# EAGLE design Arduino Accelerometer (EAGLE 5.11)
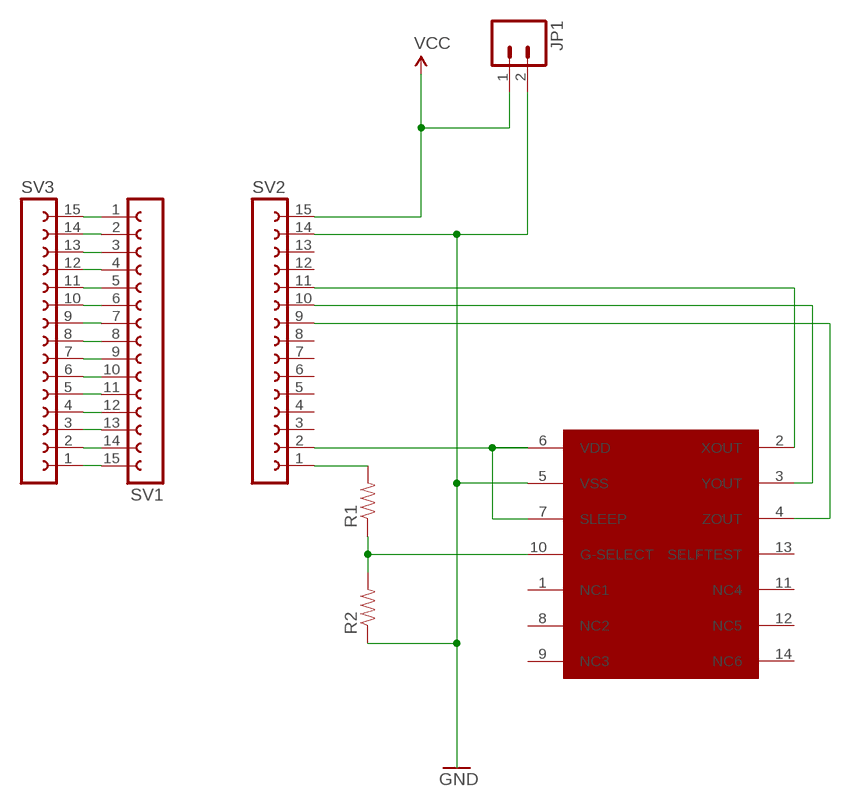
[diagram p0: schematic, sheet 1]

## Parts
JP1  M02LOCK  [1X02_LOCK]
R1  RESISTORPTH-1/4W  [AXIAL-0.4]
R2  RESISTORPTH-1/4W  [AXIAL-0.4]
SV1  FE15-1  [FE15]
SV2  FE15-1  [FE15]
SV3  FE15-1  [FE15]
U$1  MMA7331LC  [LGA14]

## Nets
BLAH: R1.P$1 R2.P$2 U$1.10(G-SELECT)
GND: JP1.2 R2.P$1 SV2.14 U$1.5(VSS)
N$1: SV2.2 U$1.6(VDD) U$1.7(SLEEP)
N$2: SV2.11 U$1.2(XOUT)
N$3: SV2.10 U$1.3(YOUT)
N$4: SV2.9 U$1.4(ZOUT)
N$5: SV1.1 SV3.15
N$6: SV1.2 SV3.14
N$7: R1.P$2 SV2.1
N$8: SV1.5 SV3.11
N$9: SV1.4 SV3.12
N$10: SV1.6 SV3.10
N$11: SV1.7 SV3.9
N$12: SV1.3 SV3.13
N$13: SV1.8 SV3.8
N$14: SV1.9 SV3.7
N$15: SV1.10 SV3.6
N$16: SV1.11 SV3.5
N$17: SV1.12 SV3.4
N$18: SV1.14 SV3.2
N$19: SV1.15 SV3.1
N$20: SV1.13 SV3.3
VCC: JP1.1 SV2.15
Unconnected: SV2.3 SV2.4 SV2.5 SV2.6 SV2.7 SV2.8 SV2.12 SV2.13 U$1.1(NC1) U$1.8(NC2) U$1.9(NC3) U$1.11(NC4) U$1.12(NC5) U$1.13(SELFTEST) U$1.14(NC6)

## Library data of the parts
JP1 = SparkFun:M02: Header 2 Standard 2-pin 0.1" header. Use with straight break away headers (SKU : PRT-00116), right angle break away headers (PRT-00553), swiss pins (PRT-00743), machine pins (PRT-00117), and female headers (PRT-00115). Molex polarized connector foot print use with SKU : PRT-08233 with associated crimp pins and housings.
R1 R2 = SparkFun:RESISTOR: Resistor Basic schematic elements and footprints for 0603, 1206, and PTH resistors.
SV1-SV3 = con-lsta:FE15-1: FEMALE HEADER; OC_FARNELL: unknown; OC_NEWARK: unknown
U$1 = SparkFun:MMA7331LC

## Board
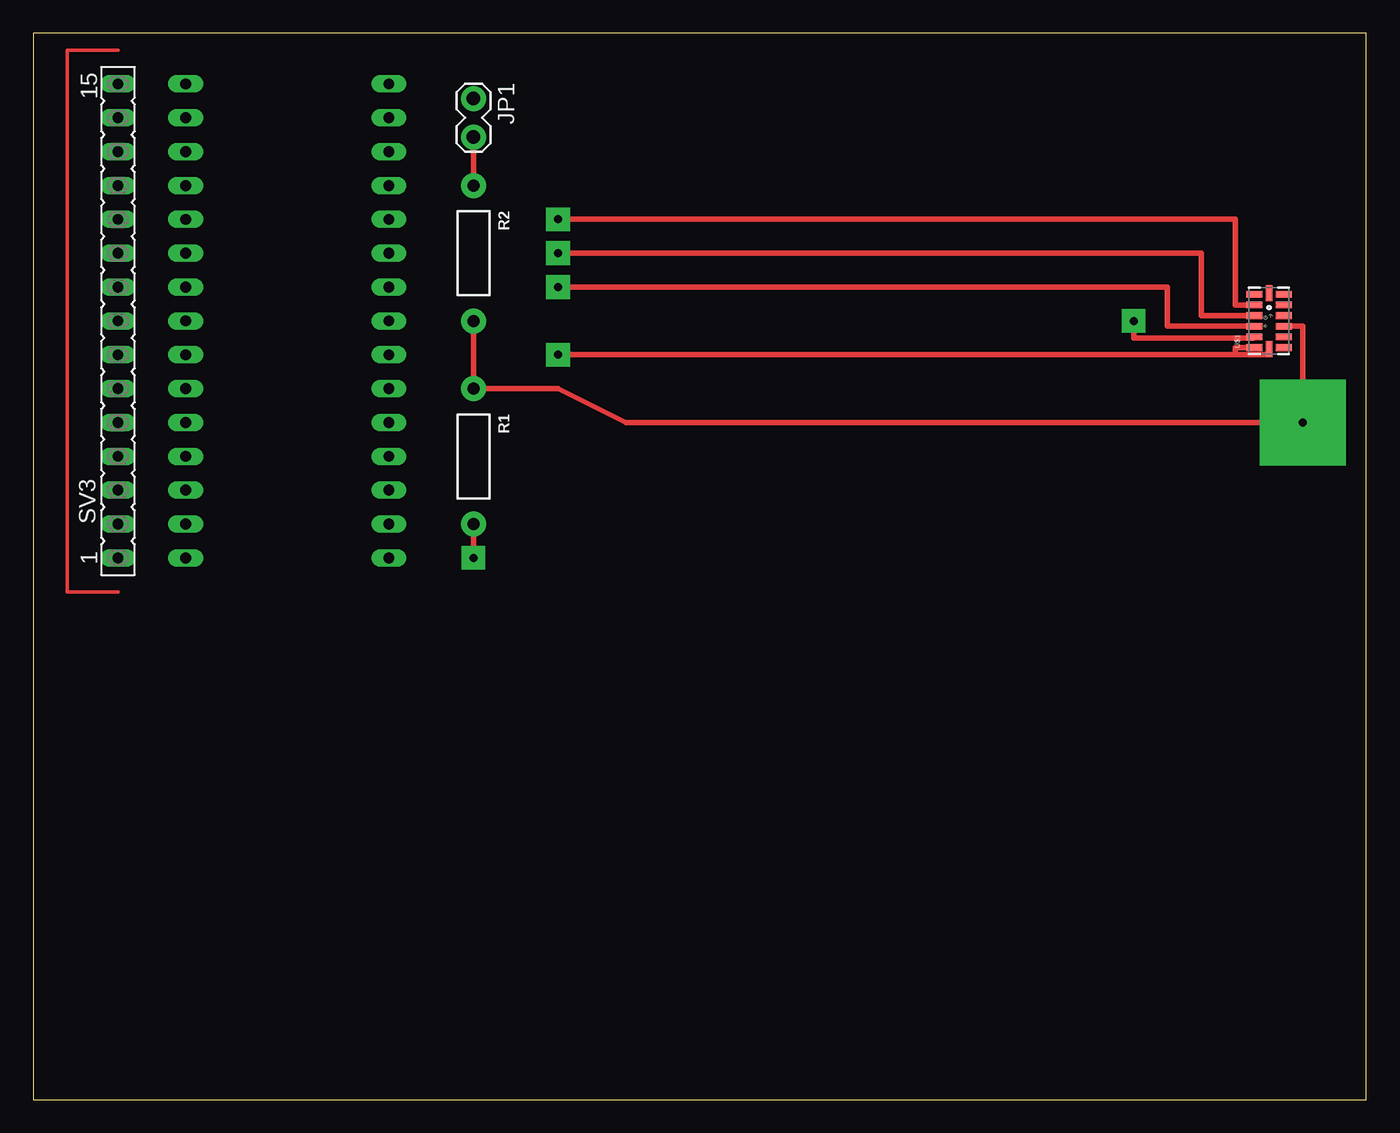
[diagram p1: board, top side]
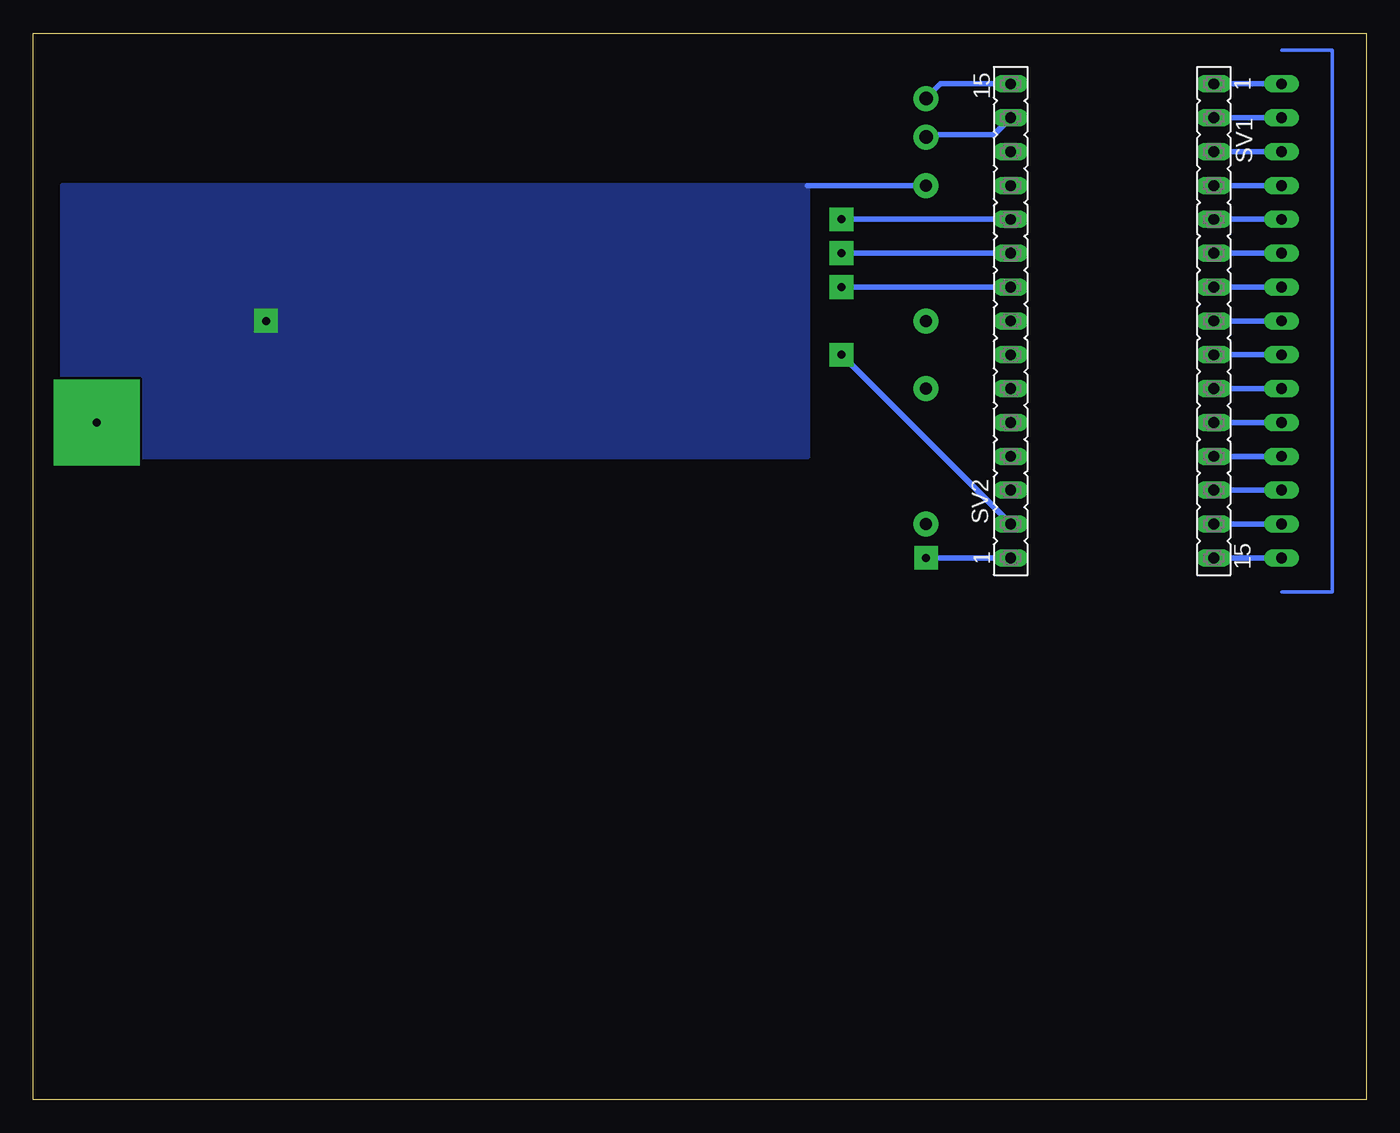
[diagram p2: board, bottom side, seen from below]

Size 100 x 80 mm. Coordinates in mm from the lower left corner, seen from the top.
Outline: 0,0 100,0 100,80 0,80 0,0
Copper layers (1*16): Top 0.035mm / dielectric 1.5mm / Bottom 0.035mm
Design rules "default": minimum track width 10mil, minimum drill 24mil, track to track 8mil, track to pad 8mil, pad to pad 8mil, via to via 8mil, smd to smd 8mil, copper to edge 40mil, drill to drill 8mil, minimum pad ring 10mil, minimum via ring 8mil, stop-mask expansion 4mil, vias tented up to drill 0mil, thermal gap 10mil

### Footprints (pad centres in the part's own frame; a part is rotated, then mirrored left to right if it is on the bottom)
1X02_LOCK = drill 1.016 pad 1.88 round: 1 -0.178,0; 2 2.718,0
AXIAL-0.4 = drill 0.9 pad 1.88 round: P$1 -5.08,0; P$2 5.08,0
FE15 = drill 0.813 long: 1 -17.78,0; 2 -15.24,0; 3 -12.7,0; 4 -10.16,0; 5 -7.62,0; 6 -5.08,0; 7 -2.54,0; 8 0,0; 9 2.54,0; 10 5.08,0; 11 7.62,0; 12 10.16,0; 13 12.7,0; 14 15.24,0; 15 17.78,0
LGA14 = smd 0.5 x 1.2: 1 2,1.1; 2 1.2,1.1; 3 0.4,1.1; 4 -0.4,1.1; 5 -1.2,1.1; 6 -2,1.1; 8 -2,-1.1; 9 -1.2,-1.1; 10 -0.4,-1.1; 11 0.4,-1.1; 12 1.2,-1.1; 13 2,-1.1 | smd 1.2 x 0.5: 7 -2.1,0; 14 2.1,0

### Placement (x,y rotation side)
JP1  33.02,74.93 270 top
R1  33.02,48.26 270 top
R2  33.02,63.5 270 top
SV1  11.43,58.42 270 bottom
SV2  26.67,58.42 90 bottom
SV3  6.35,58.42 90 top
U$1  92.71,58.42 90 top

### Tracks (layer width: path | path; a pad name or v marks a point on that pad's centre or on a via)
BLAH  (via drill 0.6 pad 6.45)
  Top 0.406: U$1.10 95.25,58.02 v95.25,50.8 44.45,50.8 39.37,53.34 R1.P$1 R2.P$2
GND  (via drill 0.6 pad 1.78)
  Top 0.254: U$1.5 91.44,57.15 | JP1.2 33.02,72.39
  Top 0.406: v82.55,58.42 82.55,57.15 91.54,57.15 U$1.5 | JP1.2 R2.P$1
  Bottom 0.254: 33.02,72.39 JP1.2
  Bottom 0.406: SV2.14 27.94,72.39 33.02,72.39 | R2.P$1 41.91,68.58
  pour Bottom: 41.91,68.58 41.91,48.26 97.79,48.26 97.79,68.58
N$1  (via drill 0.6 pad 1.78)
  Top 0.254: 92.71,55.88 U$1.7
  Top 0.406: 90.17,55.88 92.71,55.88 | U$1.6 90.17,56.42 90.17,55.88 | v39.37,55.88 90.17,55.88
  Bottom 0.406: SV2.2 v39.37,55.88
N$2  (via drill 0.6 pad 1.78)
  Top 0.406: U$1.2 90.17,59.62 90.17,66.04 v39.37,66.04
  Bottom 0.406: SV2.11 v39.37,66.04
N$3  (via drill 0.6 pad 1.78)
  Top 0.406: U$1.3 87.63,58.82 87.63,63.5 v39.37,63.5
  Bottom 0.406: SV2.10 v39.37,63.5
N$4  (via drill 0.6 pad 1.78)
  Top 0.406: U$1.4 85.09,58.02 85.09,60.96 v39.37,60.96
  Bottom 0.406: SV2.9 v39.37,60.96
N$5
  Bottom 0.406: SV3.15 SV1.1
N$6
  Bottom 0.406: SV3.14 SV1.2
N$7  (via drill 0.6 pad 1.78)
  Top 0.406: v33.02,40.64 R1.P$2
  Bottom 0.406: SV2.1 v33.02,40.64
N$8
  Bottom 0.406: SV3.11 SV1.5
N$9
  Bottom 0.406: SV3.12 SV1.4
N$10
  Bottom 0.406: SV3.10 SV1.6
N$11
  Bottom 0.406: SV3.9 SV1.7
N$12
  Bottom 0.406: SV3.13 SV1.3
N$13
  Bottom 0.406: SV3.8 SV1.8
N$14
  Bottom 0.406: SV3.7 SV1.9
N$15
  Bottom 0.406: SV3.6 SV1.10
N$16
  Bottom 0.406: SV3.5 SV1.11
N$17
  Bottom 0.406: SV3.4 SV1.12
N$18
  Bottom 0.406: SV3.2 SV1.14
N$19
  Bottom 0.406: SV3.1 SV1.15
N$20
  Bottom 0.406: SV3.3 SV1.13
N$21
  Top 0.254: 6.35,78.74 2.54,78.74 2.54,38.1 6.35,38.1
N$22
  Bottom 0.254: 6.35,78.74 2.54,78.74 2.54,38.1 6.35,38.1
VCC
  Top 0.254: JP1.1 33.02,74.93
  Bottom 0.406: SV2.15 31.93,76.2 JP1.1